# Altium schematic sheet FC_schemetic.SchDoc
size 449 x 241 mm; SheetNumber: 1; SheetTotal: 2; SPICEModelCacheGWGPYTAI: <root> / <DocumentId>GWGPYTAI</DocumentId> / <CacheFrame Number="0"> / <Model Name="xtal" Kind="CKT"> / <Text>*Generic type:crystal pkg:HC33/51 / .SUBCKT XTAL 1 2 PARAMS: FREQ=1Meg RS=750 C=13pf Q=1000 / LX 1 3 {((Q*RS)/(6.2831852*FREQ))} IC=0.5M / CX 3 4 {(1/(Q*6.2831852*FREQ*RS))} / C0 1 2 {C} / RS 4 2 {RS} / .ENDS XTAL</Text> / </Model> / <Model Name="cap" Kind="MDL"> / <Text>*Default semiconductor capacitor / .MODEL CAP C()</Text> / </Model> / <Model Name="11dq03" Kind="MDL"> / <Text>*11DQ03 MCE 7-17-95 / *Ref: IR Power Semiconductors Product Digest '94 / *MCE 30V 1.1A pkg:DIODE0.4 1,2 / .MODEL 11DQ03 D(IS=5.18E-9 RS=0.146 N=0.878 TT=4.32E-6 CJO=1.18E-10 / + VJ=0.75 M=0.333 EG=0.69 XTI=2 BV=30 IBV=6.01E-6 )</Text> / </Model> / </CacheFrame> / </root>
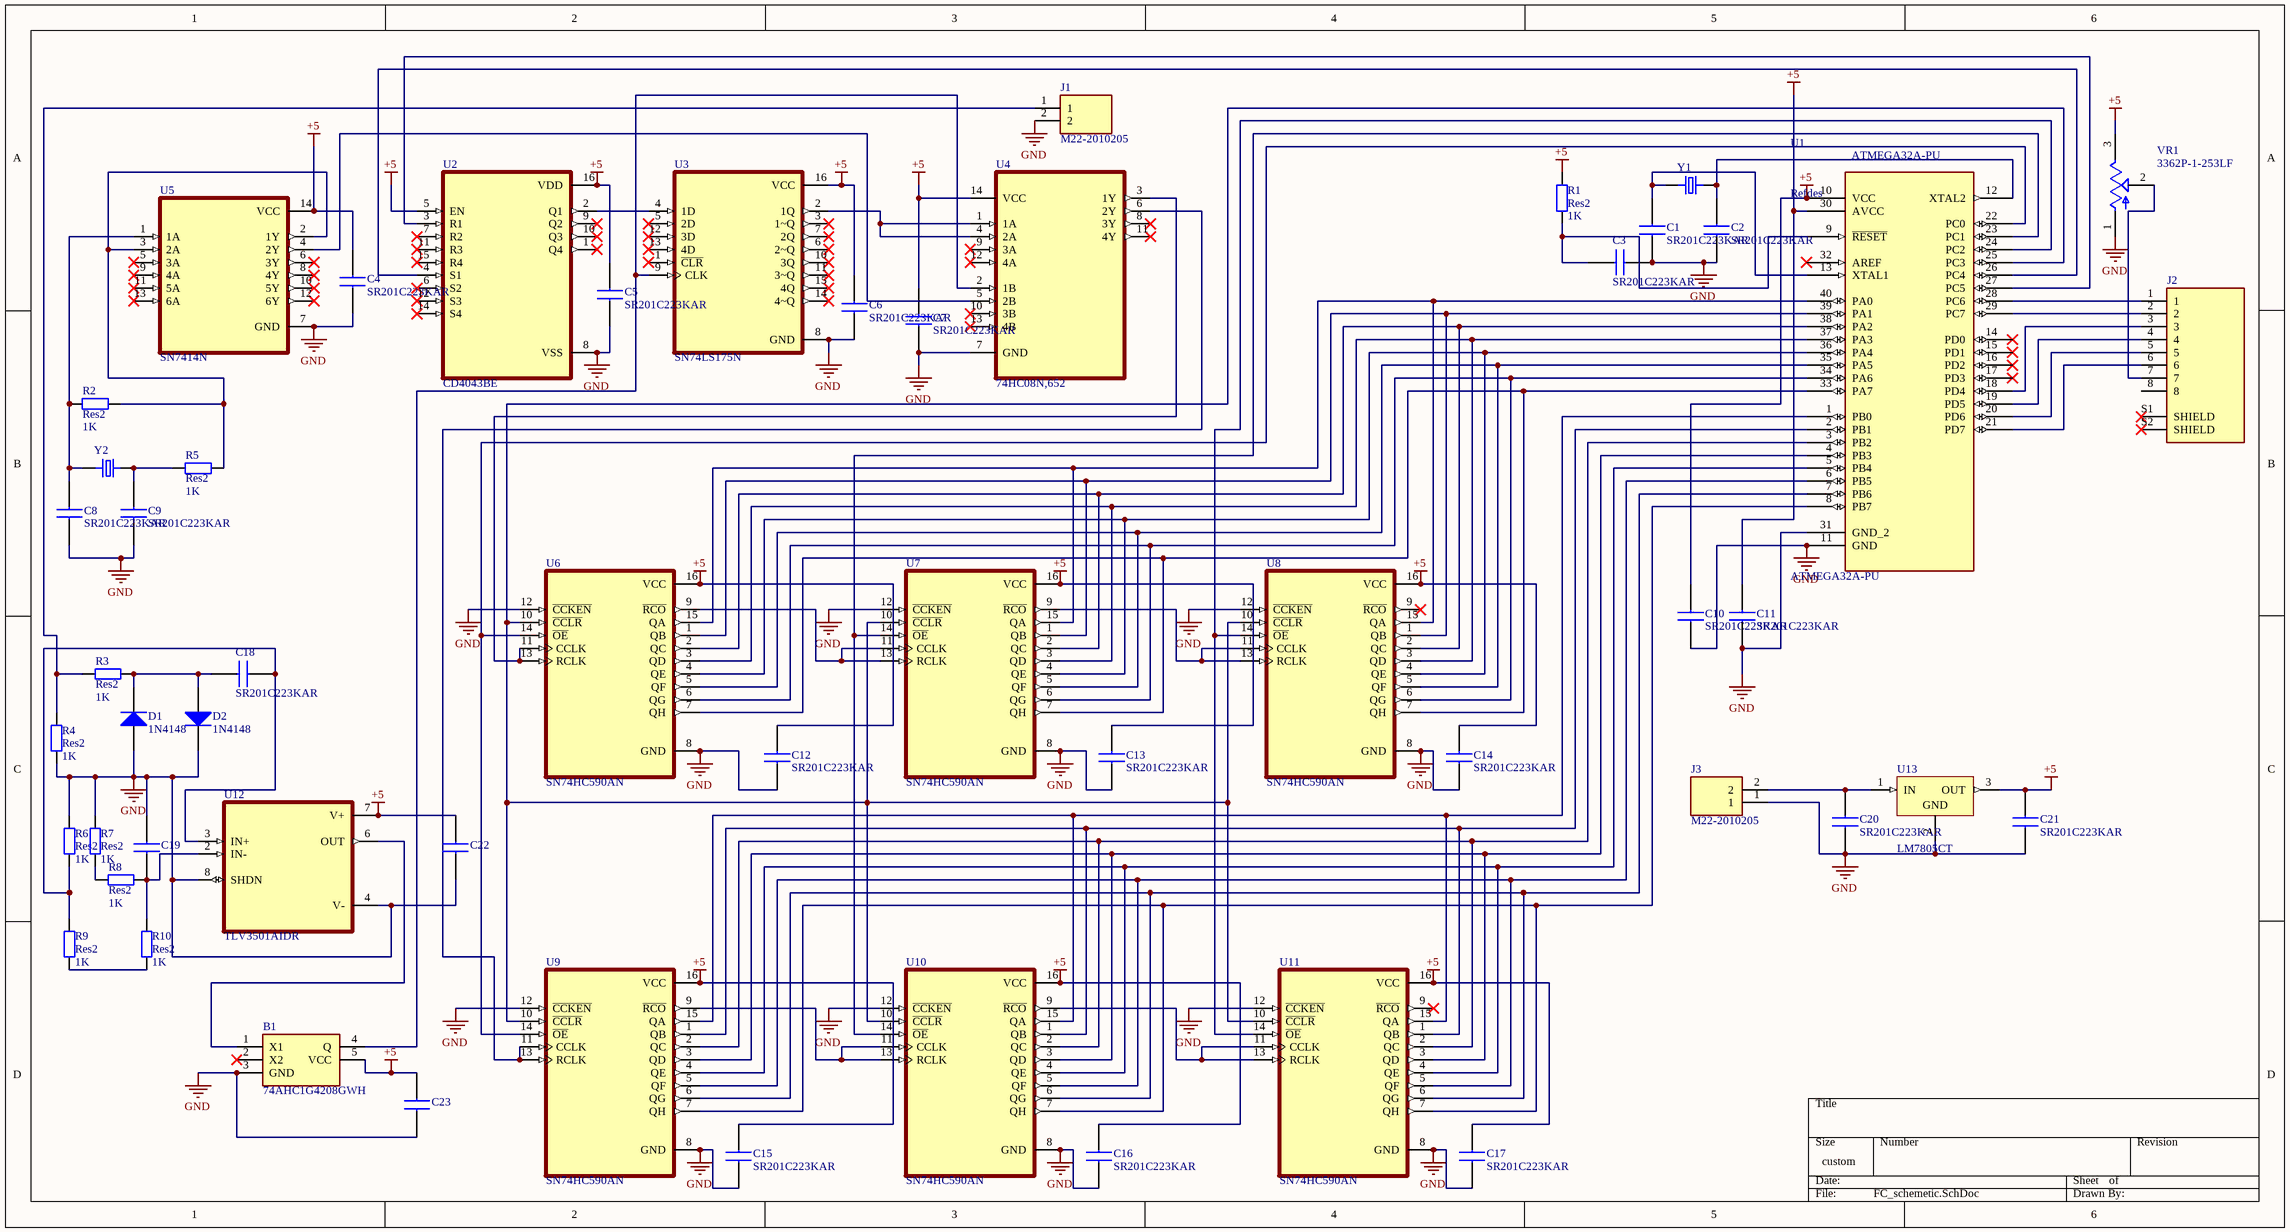
[diagram p0: FC_schemetic.SchDoc]

## Parts
B1  74AHC1G4208GWH  [SOT65P212X110-5N]
C1  SR201C223KAR  [AVX-SR20]
C2  SR201C223KAR  [AVX-SR20]
C3  SR201C223KAR  [AVX-SR20]
C4  SR201C223KAR  [AVX-SR20]
C5  SR201C223KAR  [AVX-SR20]
C6  SR201C223KAR  [AVX-SR20]
C7  SR201C223KAR  [AVX-SR20]
C8  SR201C223KAR  [AVX-SR20]
C9  SR201C223KAR  [AVX-SR20]
C10  SR201C223KAR  [AVX-SR20]
C11  SR201C223KAR  [AVX-SR20]
C12  SR201C223KAR  [AVX-SR20]
C13  SR201C223KAR  [AVX-SR20]
C14  SR201C223KAR  [AVX-SR20]
C15  SR201C223KAR  [AVX-SR20]
C16  SR201C223KAR  [AVX-SR20]
C17  SR201C223KAR  [AVX-SR20]
C18  SR201C223KAR  [AVX-SR20]
C19  SR201C223KAR  [AVX-SR20]  (value not drawn)
C20  SR201C223KAR  [AVX-SR20]
C21  SR201C223KAR  [AVX-SR20]
C22  SR201C223KAR  [AVX-SR20]  (value not drawn)
C23  SR201C223KAR  [AVX-SR20]  (value not drawn)
D1  1N4148  [NXP-SOD27-2_V]
D2  1N4148  [NXP-SOD27-2_V]
J1  M22-2010205  [HDRV2W50P0X200_1X2_400X200X525P]
J2  59453-082110EDHLF  [AMPHENOL_59453-082110EDHLF]  (value not drawn)
J3  M22-2010205  [HDRV2W50P0X200_1X2_400X200X525P]
R1  Res2  value 1K  [AXIAL-0.4]
R2  Res2  value 1K  [AXIAL-0.4]
R3  Res2  value 1K  [AXIAL-0.4]
R4  Res2  value 1K  [AXIAL-0.4]
R5  Res2  value 1K  [AXIAL-0.4]
R6  Res2  value 1K  [AXIAL-0.4]
R7  Res2  value 1K  [AXIAL-0.4]
R8  Res2  value 1K  [AXIAL-0.4]
R9  Res2  value 1K  [AXIAL-0.4]
R10  Res2  value 1K  [AXIAL-0.4]
U1  ATMEGA32A-PU  [DIP254P1524X482-40]
U2  CD4043BE  [DIP794W45P254L1969H508Q16]
U3  SN74LS175N  [DIP794W45P254L1969H508Q16]
U4  74HC08N,652  [DIP254P762X420-14]
U5  SN7414N  [DIP794W45P254L1969H508Q14]
U6  SN74HC590AN  [DIP794W45P254L1969H508Q16]
U7  SN74HC590AN  [DIP794W45P254L1969H508Q16]
U8  SN74HC590AN  [DIP794W45P254L1969H508Q16]
U9  SN74HC590AN  [DIP794W45P254L1969H508Q16]
U10  SN74HC590AN  [DIP794W45P254L1969H508Q16]
U11  SN74HC590AN  [DIP794W45P254L1969H508Q16]
U12  TLV3501AIDR  [SOIC127P599X175-8N]
U13  LM7805CT  [FAIR-TO-220-3]
VR1  3362P-1-253LF  [TRIM_3362P-1-253LF]
Y1  ECS-240.0001-18-1X  [XTAL_ECS-200-20-1X]  (value not drawn)
Y2  ECS-240.0001-18-1X  [XTAL_ECS-200-20-1X]  (value not drawn)

## Nets
+5: B1.5(VCC) C4.2 C5.2 C6.2 C7.2 C10.2 C11.2 C12.2 C13.2 C14.2 C15.2 C16.2 C17.2 C21.2 C22.1 C23.1 R1.2 U1.10(VCC) U1.30(AVCC) U2.5(EN) U2.16(VDD) U3.16(VCC) U4.14(VCC) U5.14(VCC) U6.16(VCC) U7.16(VCC) U8.16(VCC) U9.16(VCC) U10.16(VCC) U11.16(VCC) U12.7(V+) U13.3(OUT) VR1.3(CW)
GND: B1.3(GND) C1.1 C2.1 C3.1 C4.1 C5.1 C6.1 C7.1 C8.1 C9.1 C10.1 C11.1 C12.1 C13.1 C14.1 C15.1 C16.1 C17.1 C19.1 C20.1 C21.1 C22.2 C23.2 D1.1(A) D2.2(K) J1.2 J3.1 R4.2 R6.1 R7.1 U1.11(GND) U1.31(GND_2) U2.8(VSS) U3.8(GND) U4.7(GND) U5.7(GND) U6.8(GND) U6.12(~{CCKEN}) U7.8(GND) U7.12(~{CCKEN}) U8.8(GND) U8.12(~{CCKEN}) U9.8(GND) U9.12(~{CCKEN}) U10.8(GND) U10.12(~{CCKEN}) U11.8(GND) U11.12(~{CCKEN}) U12.4(V-) U12.8(SHDN) U13.2(GND) VR1.1(CCW)
NetB1_1: B1.1(X1) U12.6(OUT)
NetB1_4: B1.4(Q) U3.9(CLK) U4.2(1B)
NetC1_2: C1.2 U1.13(XTAL1) Y1.1
NetC2_2: C2.2 U1.12(XTAL2) Y1.2
NetC3_2: C3.2 R1.1 U1.9(~{RESET})
NetC8_2: C8.2 R2.2 U5.1(1A) Y2.1
NetC9_2: C9.2 R5.2 Y2.2
NetC18_1: C18.1 R6.2 R9.1 U12.3(IN+)
NetC18_2: C18.2 D1.2(K) D2.1(A) R3.1
NetC19_2: C19.2 R8.2 R10.1 U12.2(IN-)
NetC20_2: C20.2 J3.2 U13.1(IN)
NetJ1_1: J1.1 R3.2 R4.1
NetJ2_1: J2.1 U1.28(PC6)
NetJ2_2: J2.2 U1.29(PC7)
NetJ2_3: J2.3 U1.18(PD4)
NetJ2_4: J2.4 U1.19(PD5)
NetJ2_5: J2.5 U1.20(PD6)
NetJ2_6: J2.6 U1.21(PD7)
NetJ2_7: J2.7 VR1.2(WIPER)
NetR2_1: R2.1 R5.1 U5.2(1Y) U5.3(2A)
NetR7_2: R7.2 R8.1
NetR9_2: R9.2 R10.2
NetU1_1: U1.1(PB0) U9.15(QA) U10.15(QA) U11.15(QA)
NetU1_2: U1.2(PB1) U9.1(QB) U10.1(QB) U11.1(QB)
NetU1_3: U1.3(PB2) U9.2(QC) U10.2(QC) U11.2(QC)
NetU1_4: U1.4(PB3) U9.3(QD) U10.3(QD) U11.3(QD)
NetU1_5: U1.5(PB4) U9.4(QE) U10.4(QE) U11.4(QE)
NetU1_6: U1.6(PB5) U9.5(QF) U10.5(QF) U11.5(QF)
NetU1_7: U1.7(PB6) U9.6(QG) U10.6(QG) U11.6(QG)
NetU1_8: U1.8(PB7) U9.7(QH) U10.7(QH) U11.7(QH)
NetU1_22: U1.22(PC0) U6.14(~{OE}) U9.14(~{OE})
NetU1_23: U1.23(PC1) U7.14(~{OE}) U10.14(~{OE})
NetU1_24: U1.24(PC2) U8.14(~{OE}) U11.14(~{OE})
NetU1_25: U1.25(PC3) U6.10(~{CCLR}) U7.10(~{CCLR}) U8.10(~{CCLR}) U9.10(~{CCLR}) U10.10(~{CCLR}) U11.10(~{CCLR})
NetU1_26: U1.26(PC4) U2.4(S1)
NetU1_27: U1.27(PC5) U2.3(R1)
NetU1_33: U1.33(PA7) U6.7(QH) U7.7(QH) U8.7(QH)
NetU1_34: U1.34(PA6) U6.6(QG) U7.6(QG) U8.6(QG)
NetU1_35: U1.35(PA5) U6.5(QF) U7.5(QF) U8.5(QF)
NetU1_36: U1.36(PA4) U6.4(QE) U7.4(QE) U8.4(QE)
NetU1_37: U1.37(PA3) U6.3(QD) U7.3(QD) U8.3(QD)
NetU1_38: U1.38(PA2) U6.2(QC) U7.2(QC) U8.2(QC)
NetU1_39: U1.39(PA1) U6.1(QB) U7.1(QB) U8.1(QB)
NetU1_40: U1.40(PA0) U6.15(QA) U7.15(QA) U8.15(QA)
NetU2_2: U2.2(Q1) U3.4(1D)
NetU3_2: U3.2(1Q) U4.1(1A) U4.4(2A)
NetU4_3: U4.3(1Y) U6.11(CCLK) U6.13(RCLK)
NetU4_5: U4.5(2B) U5.4(2Y)
NetU4_6: U4.6(2Y) U9.11(CCLK) U9.13(RCLK)
NetU6_9: U6.9(~{RCO}) U7.11(CCLK) U7.13(RCLK)
NetU7_9: U7.9(~{RCO}) U8.11(CCLK) U8.13(RCLK)
NetU9_9: U9.9(~{RCO}) U10.11(CCLK) U10.13(RCLK)
NetU10_9: U10.9(~{RCO}) U11.11(CCLK) U11.13(RCLK)

Not connected (* = marked no-connect by the designer): B1 2(X2)*; J2 8 S1(SHIELD)* S2(SHIELD)*; U1 14(PD0)* 15(PD1)* 16(PD2)* 17(PD3)* 32(AREF)*; U2 1(Q4)* 6(S2)* 7(R2)* 9(Q2)* 10(Q3)* 11(R3)* 12(S3)* 14(S4)* 15(R4)*; U3 1(~{CLR})* 3(1~Q)* 5(2D)* 6(2~Q)* 7(2Q)* 10(3Q)* 11(3~Q)* 12(3D)* 13(4D)* 14(4~Q)* 15(4Q)*; U4 8(3Y)* 9(3A)* 10(3B)* 11(4Y)* 12(4A)* 13(4B)*; U5 5(3A)* 6(3Y)* 8(4Y)* 9(4A)* 10(5Y)* 11(5A)* 12(6Y)* 13(6A)*; U8 9(~{RCO})*; U11 9(~{RCO})*

## Notes on the sheet
- (in symbol ATMEGA32A-PU) Refdes

## Library data of the parts
B1 = 74AHC1G4208GWH: vp_74AHC1G4208.ditamap - 8-stage divider and oscillator@en-us; Manufacturer_Name: Nexperia; Geometry.Height: 1.1mm; Manufacturer_Part_Number: 74AHC1G4208GWH; Mouser Part Number: 771-74AHC1G4208GWH; Mouser Price/Stock: https://www.mouser.co.uk/ProductDetail/Nexperia/74AHC1G4208GWH?qs=17u8i%2FzlE8%2FxKrIMt8zS2A%3D%3D; Arrow Part Number: 74AHC1G4208GWH; Arrow Price/Stock: https://www.arrow.com/en/products/74ahc1g4208gwh/nexperia?region=nac; Datasheet Link: https://assets.nexperia.com/documents/data-sheet/74AHC1G4208.pdf
C1-C23 = SR201C223KAR: Cap Ceramic 0.022uF 100V X7R 10% Radial 2.54mm 125C Bulk; Manufacturer_Name: AVX; Manufacturer_Part_Number: SR201C223KAR; Mouser Part Number: *; Mouser Price/Stock: *; Arrow Part Number: SR201C223KAR; Arrow Price/Stock: https://www.arrow.com/en/products/sr201c223kar/avx; Datasheet Link: http://datasheets.avx.com/SR-Series.pdf
D1 D2 = CMP-004-00000-2: High Speed Diode, 100 V, 0.45 A, -65 to 175 degC, 2-Pin SOD27, RoHS, Bulk; Manufacturer: Fairchild; Elements: 1; Recovery Time: 4ns; Forward Current: 300mA; Power: 500mW; Forward Voltage: 1V; Max Surge Current: 4A; Peak Reverse Current: 5uA; Datasheet URL: http://www.nxp.com/documents/data_sheet/1N4148_1N4448.pdf; Min Operating Temperature: -65°C; Manufacturer URL: https://www.fairchildsemi.com/; Packaging: Bulk; Diameter: 1.91mm; Pins: 2; Package URL: http://www.nxp.com/documents/data_sheet/1N4148_1N4448.pdf; Package Reference: SOD27; Max Operating Temperature: 175°C; Package Quantity: 2000; Case/Package: DO; Datasheet Version: Aug-04; RoHS Compliant: True
J1 J3 = M22-2010205: Header, SIL, vertical, 2 way, 2mm pitch HARWIN M22-20 Series, 2mm Pitch 2 Way 1 Row Straight PCB Header, Solder Termination, 1A; Geometry.Height: 5.25mm; Manufacturer_Name: Harwin; Manufacturer_Part_Number: M22-2010205; Mouser Part Number: 855-M22-2010205; Mouser Price/Stock: https://www.mouser.co.uk/ProductDetail/Harwin/M22-2010205?qs=xxdqPuaJ%252Ba2I8VeWvpQIzQ%3D%3D; Arrow Part Number: *; Arrow Price/Stock: *; Datasheet Link: http://uk.rs-online.com/web/p/products/6813287
J2 = 59453-082110EDHLF: 0.50mm Flex Connectors, FPC/FFC Side Entry ZIF Connector, Surface Mount, 8 Positions, Top Contact, 0.50mm (0.020in) Pitch; MF: Amphenol ICC (FCI); Price: None; Package: None; Value: *; Check_prices: https://www.snapeda.com/parts/59453-082110EDHLF/Amphenol%20FCI/view-part/5519599/?ref=eda; SnapEDA_Link: https://www.snapeda.com/parts/59453-082110EDHLF/Amphenol%20FCI/view-part/5519599/?ref=snap; Availability: In Stock; MP: 59453-082110EDHLF
R1-R10 = Res2: Resistor; Published: 8-Jun-2000; LatestRevisionDate: 17-Jul-2002; LatestRevisionNote: Re-released for DXP Platform.; PackageReference: AXIAL-0.4; Publisher: Altium Limited; PackageDescription: Axial Device, Thru-Hole; 2 Leads; 0.4 in Pin Spacing
U1 = ATMEGA32A-PU: AVR AVRÂ® ATmega Microcontroller IC 8-Bit 16MHz 32KB (16K x 16) FLASH 40-PDIP; MF: Microchip; Price: None; Availability: In Stock; Package: PDIP-40 Microchip; MP: ATMEGA32A-PU; Value: *; SnapEDA_Link: https://www.snapeda.com/parts/ATMEGA32A-PU/Microchip/view-part/?ref=snap; Purchase-URL: https://pricing.snapeda.com/search/part/ATMEGA32A-PU/?ref=eda; Check_prices: https://www.snapeda.com/parts/ATMEGA32A-PU/Microchip/view-part/?ref=eda
U2 = CD4043BE: CMOS Quad NOR R/S Latch with 3-State Outputs 16-PDIP -55 to 125; MF: Texas Instruments; Value: *; Arrow_Electronics-Purchase-URL: https://snapeda.com/shop?store=Arrow+Electronics&id=577167; Package: PDIP-16 Texas Instruments; DigiKey-Purchase-URL: https://snapeda.com/shop?store=DigiKey&id=577167; Mouser-Purchase-URL: https://snapeda.com/shop?store=Mouser&id=577167; Price: None; MP: CD4043BE; Availability: Good; SnapEDA_Link: https://www.snapeda.com/parts/CD4043BE/Texas%20Instruments/view-part/577167/?ref=snap; Texas_Instruments-Purchase-URL: https://snapeda.com/shop?store=Texas+Instruments&id=577167; BuyPart: https://www.snapeda.com/parts/CD4043BE/Texas%20Instruments/view-part/577167/?ref=eda
U3 = SN74LS175N: Quadruple D-Type Flip-Flops With Clear 16-PDIP 0 to 70; MF: Texas Instruments; MP: SN74LS175N; SnapEDA_Link: https://www.snapeda.com/parts/SN74LS175N/Texas%20Instruments/view-part/572262/?ref=snap; Package: PDIP-16 Texas Instruments; Value: *; Check_prices: https://www.snapeda.com/parts/SN74LS175N/Texas%20Instruments/view-part/572262/?ref=eda; Purchase-URL: https://pricing.snapeda.com/search/part/SN74LS175N/?ref=eda; Digi-Key_Part_Number: 296-28719-2-ND
U4 = 74HC08N,652: AND Gate IC 4 Channel 14-DIP; MF: NXP USA; Availability: Warning; MP: 74HC08N,652; DigiKey-Purchase-URL: https://snapeda.com/shop?store=DigiKey&id=41634; Value: *; SnapEDA_Link: https://www.snapeda.com/parts/74HC08N,652/NXP%20USA%20Inc./view-part/41634/?ref=snap; Price: None; Package: DIP-14 NXP Semiconductors; BuyPart: https://www.snapeda.com/parts/74HC08N,652/NXP%20USA%20Inc./view-part/41634/?ref=eda
U5 = SN7414N: Hex schmitt-trigger inverters 14-PDIP 0 to 70; MF: Texas Instruments; Price: None; MP: SN7414N; DigiKey-Purchase-URL: https://snapeda.com/shop?store=DigiKey&id=51455; Value: *; Package: PDIP-14 Texas Instruments; Mouser-Purchase-URL: https://snapeda.com/shop?store=Mouser&id=51455; SnapEDA_Link: https://www.snapeda.com/parts/SN7414N/Texas%20Instruments/view-part/51455/?ref=snap; Availability: Warning; Texas_Instruments-Purchase-URL: https://snapeda.com/shop?store=Texas+Instruments&id=51455; Check_prices: https://www.snapeda.com/parts/SN7414N/Texas%20Instruments/view-part/51455/?ref=eda
U6-U11 = SN74HC590AN: 8-Bit Binary Counters With 3-State Output Registers 16-PDIP -40 to 85; MF: Texas Instruments; Value: *; MP: SN74HC590AN; SnapEDA_Link: https://www.snapeda.com/parts/SN74HC590AN/Texas%20Instruments/view-part/385662/?ref=snap; Package: PDIP-16 Texas Instruments; Digi-Key_Part_Number: SN74HC590ANG4-ND; Texas_Instruments-Purchase-URL: https://snapeda.com/shop?store=Texas+Instruments&id=385662; BuyPart: https://www.snapeda.com/parts/SN74HC590AN/Texas%20Instruments/view-part/385662/?ref=eda
U12 = TLV3501AIDR: 4.5ns, Rail-to-Rail, High Speed Comparator with Shutdown 8-SOIC -40 to 125; MF: Texas Instruments; MP: TLV3501AIDR; Purchase-URL: https://pricing.snapeda.com/search/part/TLV3501AIDR/?ref=eda; Package: SOIC-8 Texas Instruments; Value: *; Digi-Key_Part_Number: 296-43611-1-ND; Check_prices: https://www.snapeda.com/parts/TLV3501AIDR/Texas+Instruments/view-part/?ref=eda; SnapEDA_Link: https://www.snapeda.com/parts/TLV3501AIDR/Texas+Instruments/view-part/?ref=snap
U13 = CMP-2000-04938-1: Positive Voltage Regulator, 5 V, 1 A, -40 to 125 degC, 3-Pin TO-220, RoHS, Tube; Manufacturer: FairchildSemiconductor; Maximum Input Voltage: 35V; Maximum Quiescent Current: 8mA; Load Regulation: 100mV; Maximum Output Current: 2.2(Typ)A; Output Type: Fixed; Typical Dropout Voltage @ Current: 2@1AV; Rad Hard: No; Output Voltage: 5V; Accuracy: ±4%; Number of Outputs: 1; Category: LinearRegulator; Package Description: 3-Pin Through Hole Device, Body 10 x 4.5 mm, Pitch 2.54 mm; Packaging: Rail/Tube; Mounting: ThroughHole; Polarity: Positive; Manufacturer URL: https://www.fairchildsemi.com/; Line Regulation: 100mV; Datasheet Version: Aug-12; Datasheet URL: https://datasheet.ciiva.com/26904/lm7805ct-26904988.pdf; Package Reference: TO-220; Package URL: https://www.fairchildsemi.com/package-drawings/TO/TO220B03.pdf; Package: 3TO-220AB; Operating Temperature: -40to125degC; Type: Linear
VR1 = 3362P-1-253LF: 25 kOhms 0.5W, 1/2W PC Pins Through Hole Trimmer Potentiometer Cermet 1 Turn Top Adjustment; MF: Bourns; Check_prices: https://www.snapeda.com/parts/3362P-1-253LF/Bourns/view-part/493663/?ref=eda; SnapEDA_Link: https://www.snapeda.com/parts/3362P-1-253LF/Bourns/view-part/493663/?ref=snap; Availability: Good; Value: *; Purchase-URL: https://pricing.snapeda.com/search/part/3362P-1-253LF/?ref=eda; Price: None; MP: 3362P-1-253LF; Package: 3116 Bourns
Y1 Y2 = ECS-240.0001-18-1X: Crystals / Oscillators / Resonators 24.00014MHz 18pF; MF: ECS International; Package: HC49/U ECS International; Availability: Unavailable; Value: *; MP: ECS-240.0001-18-1X; Price: None; SnapEDA_Link: https://www.snapeda.com/parts/ECS-240.0001-18-1X/ECS%20International/view-part/259232/?ref=snap